# EAGLE schematic Power_Measure_TB (EAGLE 6.1)
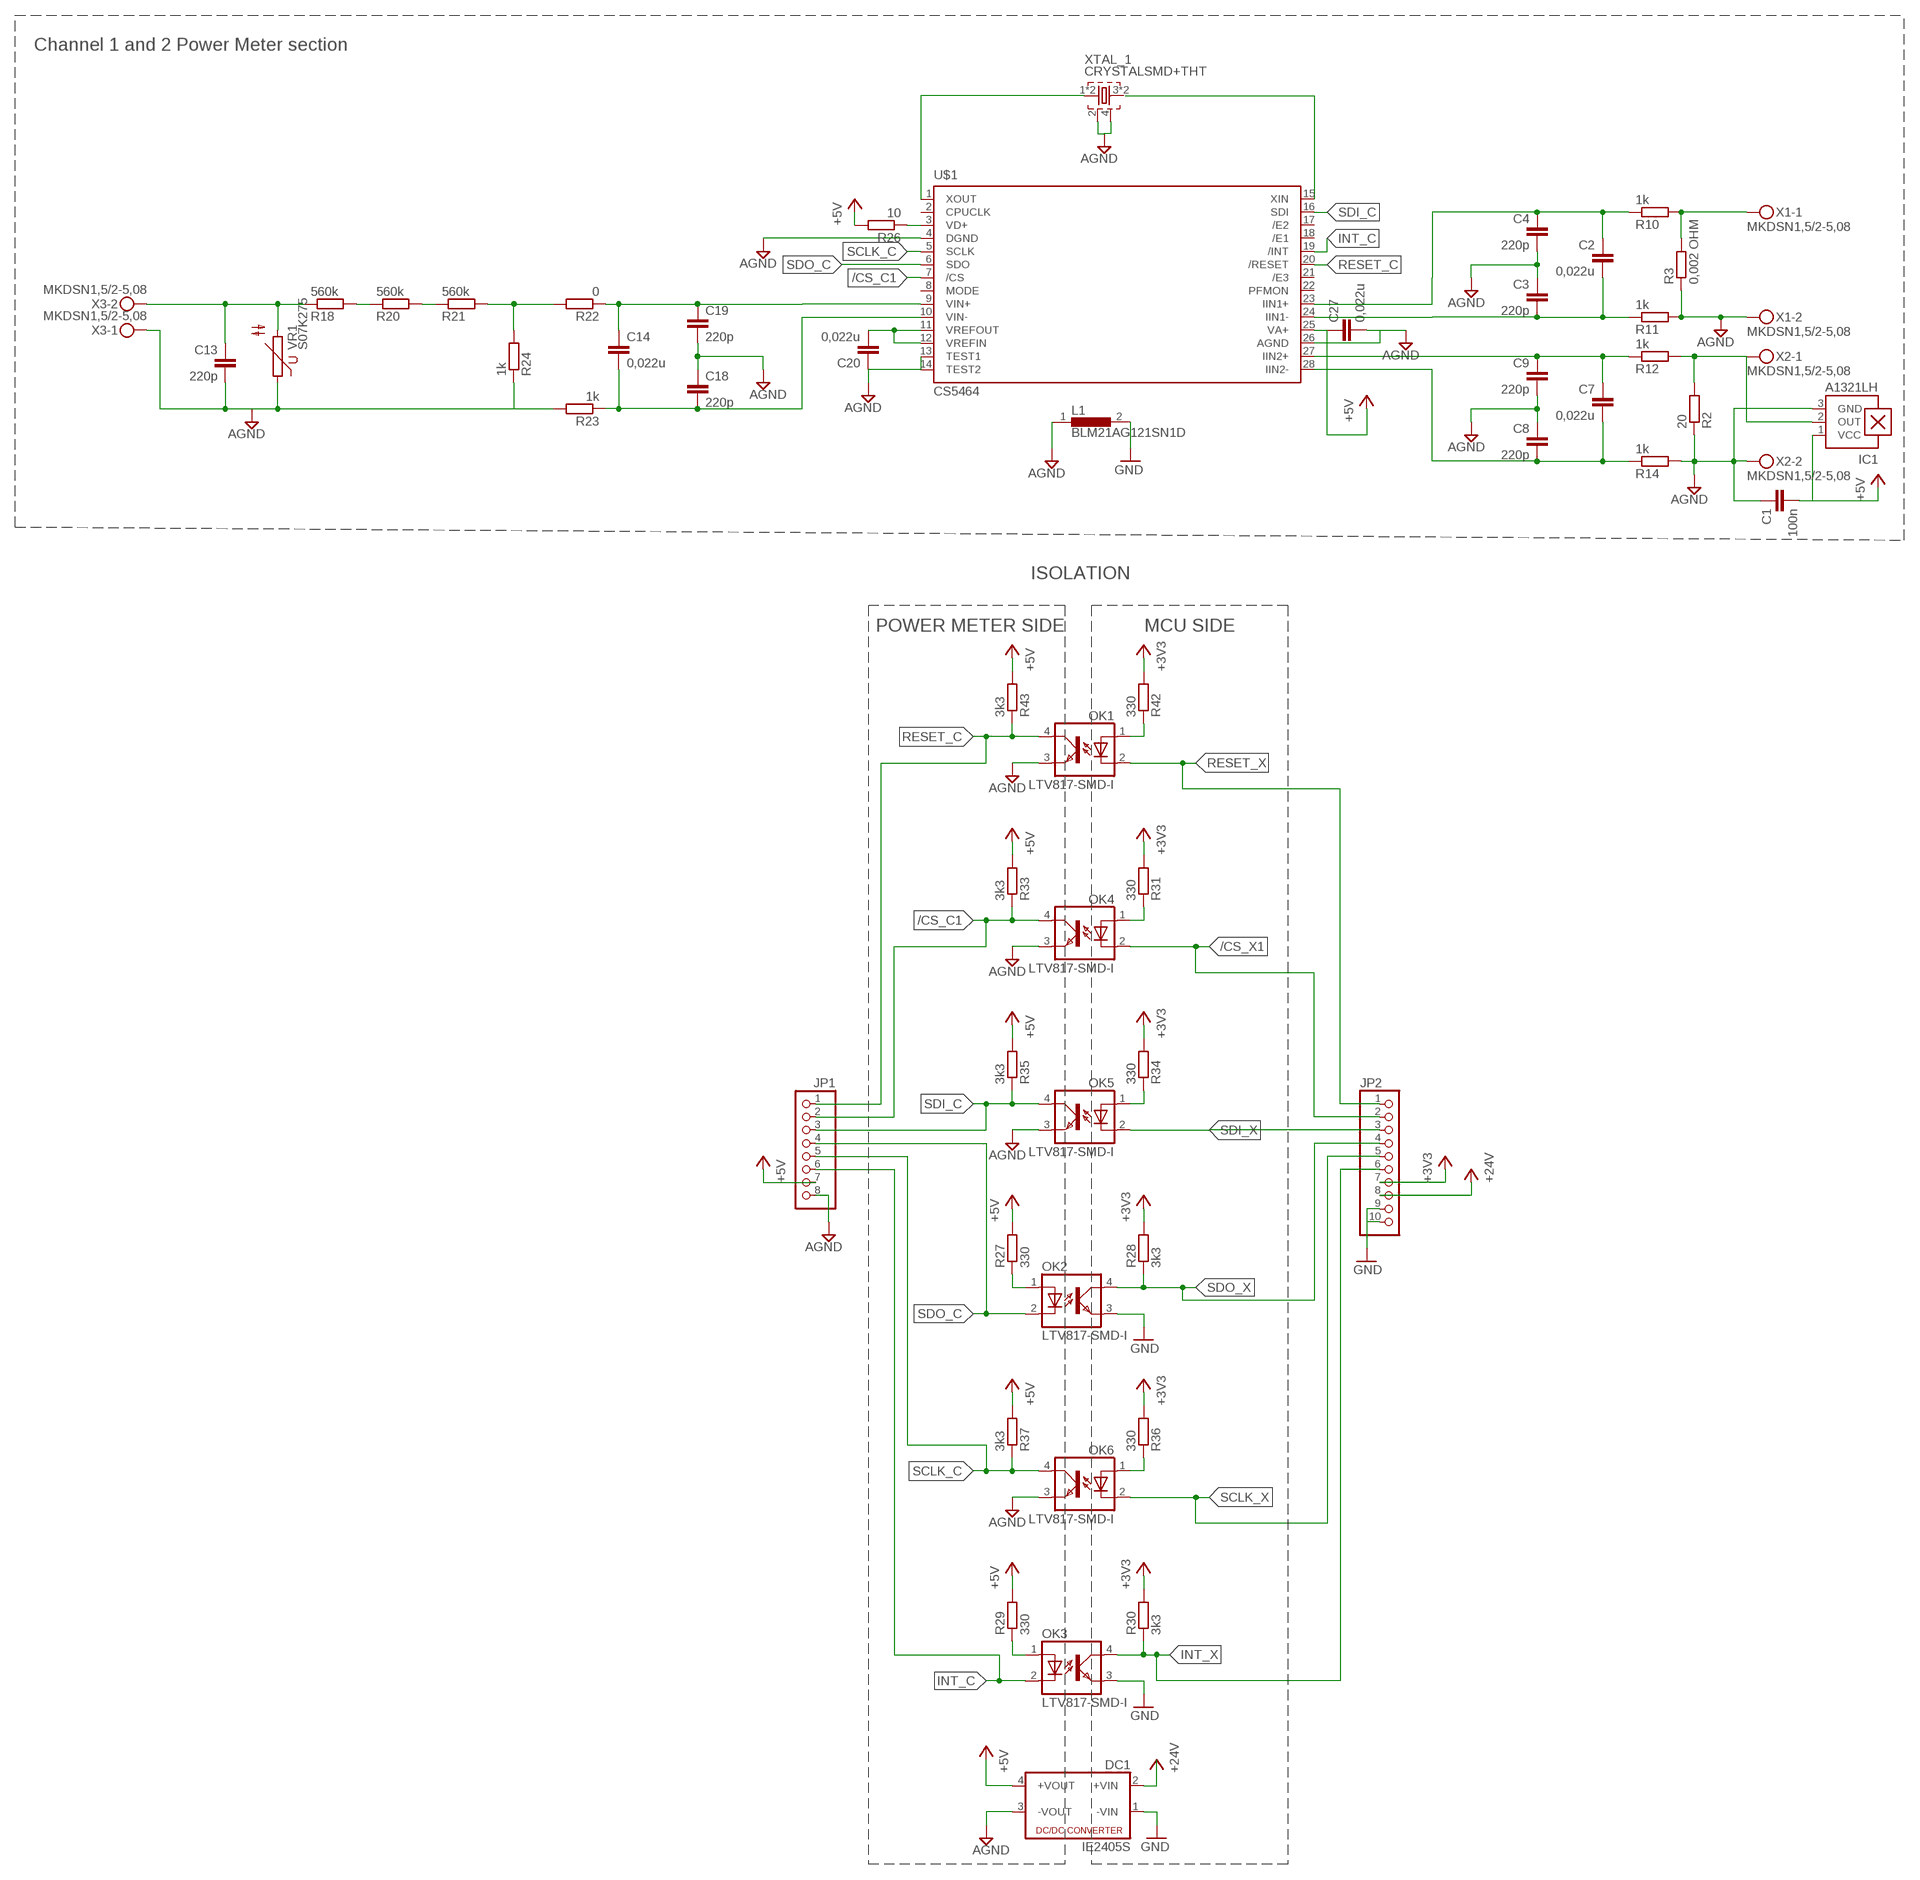
[diagram p0: schematic, sheet 1]

## Parts
C1  100n  C-EUC0603K  [C0603K]
C2  0,022u  C-EUC0603K  [C0603K]
C3  220p  C-EUC0603K  [C0603K]
C4  220p  C-EUC0603K  [C0603K]
C7  0,022u  C-EUC0603K  [C0603K]
C8  220p  C-EUC0603K  [C0603K]
C9  220p  C-EUC0603K  [C0603K]
C13  220p  C-EUC0603K  [C0603K]
C14  0,022u  C-EUC0603K  [C0603K]
C18  220p  C-EUC0603K  [C0603K]
C19  220p  C-EUC0603K  [C0603K]
C20  0,022u  C-EUC0603K  [C0603K]
C27  0,022u  C-EUC0603K  [C0603K]
DC1  IE2405S  VA-0524S  [4SIL]
IC1  A1321LH  [SOT23-W]
JP1  PINHD-1X8  [1X08]
JP2  PINHD-1X10  [1X10]
L1  BLM21AG121SN1D  [805]
OK1  LTV817-SMD-I  LTV816S  [SMD4]
OK2  LTV817-SMD-I  LTV816S  [SMD4]
OK3  LTV817-SMD-I  LTV816S  [SMD4]
OK4  LTV817-SMD-I  LTV816S  [SMD4]
OK5  LTV817-SMD-I  LTV816S  [SMD4]
OK6  LTV817-SMD-I  LTV816S  [SMD4]
R2  20  R-EU_R0603  [R0603]
R3  0,002 OHM  R-EU_R2512  [R2512]
R10  1k  R-EU_R0603  [R0603]
R11  1k  R-EU_R0603  [R0603]
R12  1k  R-EU_R0603  [R0603]
R14  1k  R-EU_R0603  [R0603]
R18  560k  R-EU_R0603  [R0603]
R20  560k  R-EU_R0603  [R0603]
R21  560k  R-EU_R0603  [R0603]
R22  0  R-EU_R0603  [R0603]
R23  1k  R-EU_R0603  [R0603]
R24  1k  R-EU_R0603  [R0603]
R26  10  R-EU_R0603  [R0603]
R27  330  R-EU_M0805  [M0805]
R28  3k3  R-EU_M0805  [M0805]
R29  330  R-EU_M0805  [M0805]
R30  3k3  R-EU_M0805  [M0805]
R31  330  R-EU_M0805  [M0805]
R33  3k3  R-EU_M0805  [M0805]
R34  330  R-EU_M0805  [M0805]
R35  3k3  R-EU_M0805  [M0805]
R36  330  R-EU_M0805  [M0805]
R37  3k3  R-EU_M0805  [M0805]
R42  330  R-EU_M0805  [M0805]
R43  3k3  R-EU_M0805  [M0805]
U$1  CS5464  [SSOP-28L]
VR1  S07K275  [S07K275]
X1  MKDSN1,5/2-5,08  [MKDSN1,5/2-5,08]
X2  MKDSN1,5/2-5,08  [MKDSN1,5/2-5,08]
X3  MKDSN1,5/2-5,08  [MKDSN1,5/2-5,08]
XTAL_1  CRYSTALSMD+THT  [CRYSTAL20H+MT38]

## Nets
+3V3: C1.2 IC1.1(VCC) JP1.7 JP2.7 R28.2 R30.2 R31.2 R34.2 R36.2 R42.2 ; supply symbol labelled +5V
+5V: C27.1 DC1.4(+VOUT) R26.2 R27.2 R29.2 R33.2 R35.2 R37.2 R43.2 U$1.25(VA+)
/CS_C1: JP1.2 OK4.4(COL) R33.1 U$1.7(/CS)
/CS_X1: JP2.2 OK4.2(C)
AGND: C1.1 C3.1 C4.2 C8.1 C9.2 C13.2 C18.1 C19.2 C20.1 C27.2 DC1.3(-VOUT) IC1.3(GND) JP1.8 L1.1 OK1.3(EMIT) OK4.3(EMIT) OK5.3(EMIT) OK6.3(EMIT) R2.1 R3.1 R11.2 R14.2 R23.2 R24.1 U$1.4(DGND) U$1.13(TEST1) U$1.14(TEST2) U$1.26(AGND) VR1.1 X1.2 X2.2 X3.1 XTAL_1.2 XTAL_1.4
GND: DC1.1(-VIN) JP2.9 JP2.10 L1.2 OK2.3(EMIT) OK3.3(EMIT)
INT_C: JP1.6 OK3.2(C) U$1.19(/INT)
INT_X: JP2.6 OK3.4(COL) R30.1
N$1: R18.2 R20.1
N$2: C7.2 C8.2 R14.1 U$1.28(IIN2-)
N$4: C2.2 C3.2 R11.1 U$1.24(IIN1-)
N$5: C13.1 R18.1 VR1.2 X3.2
N$6: C2.1 C4.1 R10.1 U$1.23(IIN1+)
N$7: R26.1 U$1.3(VD+)
N$8: C20.2 U$1.11(VREFOUT) U$1.12(VREFIN)
N$9: OK1.1(A) R42.1
N$10: OK2.1(A) R27.1
N$11: OK3.1(A) R29.1
N$12: OK4.1(A) R31.1
N$14: IC1.2(OUT) R2.2 X2.1
N$15: R3.2 R10.2 X1.1
N$18: C7.1 C9.1 R12.1 U$1.27(IIN2+)
N$32: U$1.1(XOUT) XTAL_1.1 XTAL_1.1_T
N$33: U$1.15(XIN)
N$34: R20.2 R21.1
N$35: C14.2 C18.2 R23.1 U$1.10(VIN-)
N$36: C14.1 C19.1 R22.1 U$1.9(VIN+)
N$37: OK5.1(A) R34.1
N$38: R21.2 R22.2 R24.2
N$39: OK6.1(A) R36.1
RESET_C: JP1.1 OK1.4(COL) R43.1 U$1.20(/RESET)
RESET_X: JP2.1 OK1.2(C)
SCLK_C: JP1.5 OK6.4(COL) R37.1 U$1.5(SCLK)
SCLK_X: JP2.5 OK6.2(C)
SDI_C: JP1.3 OK5.4(COL) R35.1 U$1.16(SDI)
SDI_X: JP2.3 OK5.2(C)
SDO_C: JP1.4 OK2.2(C) U$1.6(SDO)
SDO_X: JP2.4 OK2.4(COL) R28.1
VCC: DC1.2(+VIN) JP2.8 ; supply symbol labelled +24V
Unconnected: R12.2 U$1.2(CPUCLK) U$1.17(/E2) U$1.18(/E1) U$1.21(/E3) U$1.22(PFMON) XTAL_1.3 XTAL_1.3T

## Notes on the sheet
- Channel 1 and 2 Power Meter section
- ISOLATION
- POWER METER SIDE | MCU SIDE

## Power pins joined to a net without a drawn wire
MODE: U$1.8(MODE)

## Library data of the parts
C1-C4 C7-C9 C13 C14 C18-C20 C27 = rcl:C-EU: CAPACITOR, European symbol
DC1 = dc-dc-converter:VA-*?: DC DC Converter Single Output, 1 Watt Motien Technology Co.,Ltd. Source: va-serie.pdf; OC_FARNELL: unknown; OC_NEWARK: unknown
IC1 = allegro:A13*?: Linear Hall Effect Sensor ICs Continuous-Time Ratiometric High-Temperature Operation Programmable Linear with Analog Output A1302 -Replacement- UGN3503 Source: http://www.allegromicro.com/en/Products/Part_Numbers/1301/1301.pdf http://www.allegromicro.com/en/Products/Part_Numbers/1321/1321.pdf http://www.allegromicro.com/en/Products/Part_Numbers/1381/1381.pdf; MF: ALLEGRO MICROSYSTEMS, INC.; MPN: A1321LLHLT-T; OC_FARNELL: 1457116; OC_NEWARK: 65K5146
JP1 = pinhead:PINHD-1X8: PIN HEADER
JP2 = pinhead:PINHD-1X10: PIN HEADER
L1 = inductors:BLM21AG121SN1D
OK1-OK6 = optocoupler:LTV816: OPTO COUPLER Source: LITEON, LTV816.pdf; OC_FARNELL: unknown; OC_NEWARK: unknown
R2 R10-R12 R14 R18 R20-R24 R26-R31 R33-R37 R42 R43 = rcl:R-EU_: RESISTOR, European symbol
R3 = resistor:R-EU_: RESISTOR, European symbol
U$1 = myHome:CS5464
VR1 = varistor:S07K275: VARISTOR
X1-X3 = con-phoenix-508:MKDSN1,5/2-5,08: MKDSN 1,5/ 2-5,08 Printklemme Nennstrom: 13,5 A Nennspannung: 250 V Rastermaß: 5,08 mm Polzahl: 2 Anschlussart: Schraubanschluss Montage: Löten Anschlussrichtung Leiter/Platine: 0 ° Artikelnummer: 1729128 Source: http://eshop.phoenixcontact.com .. 1729128.pdf; MPN: MKDSN 1,5/2-5.08; OC_FARNELL: 1792903; OC_NEWARK: 30M2397
XTAL_1 = myHome:CRYSTALSMD+THT